# EAGLE schematic untitled (EAGLE 9.5.0)
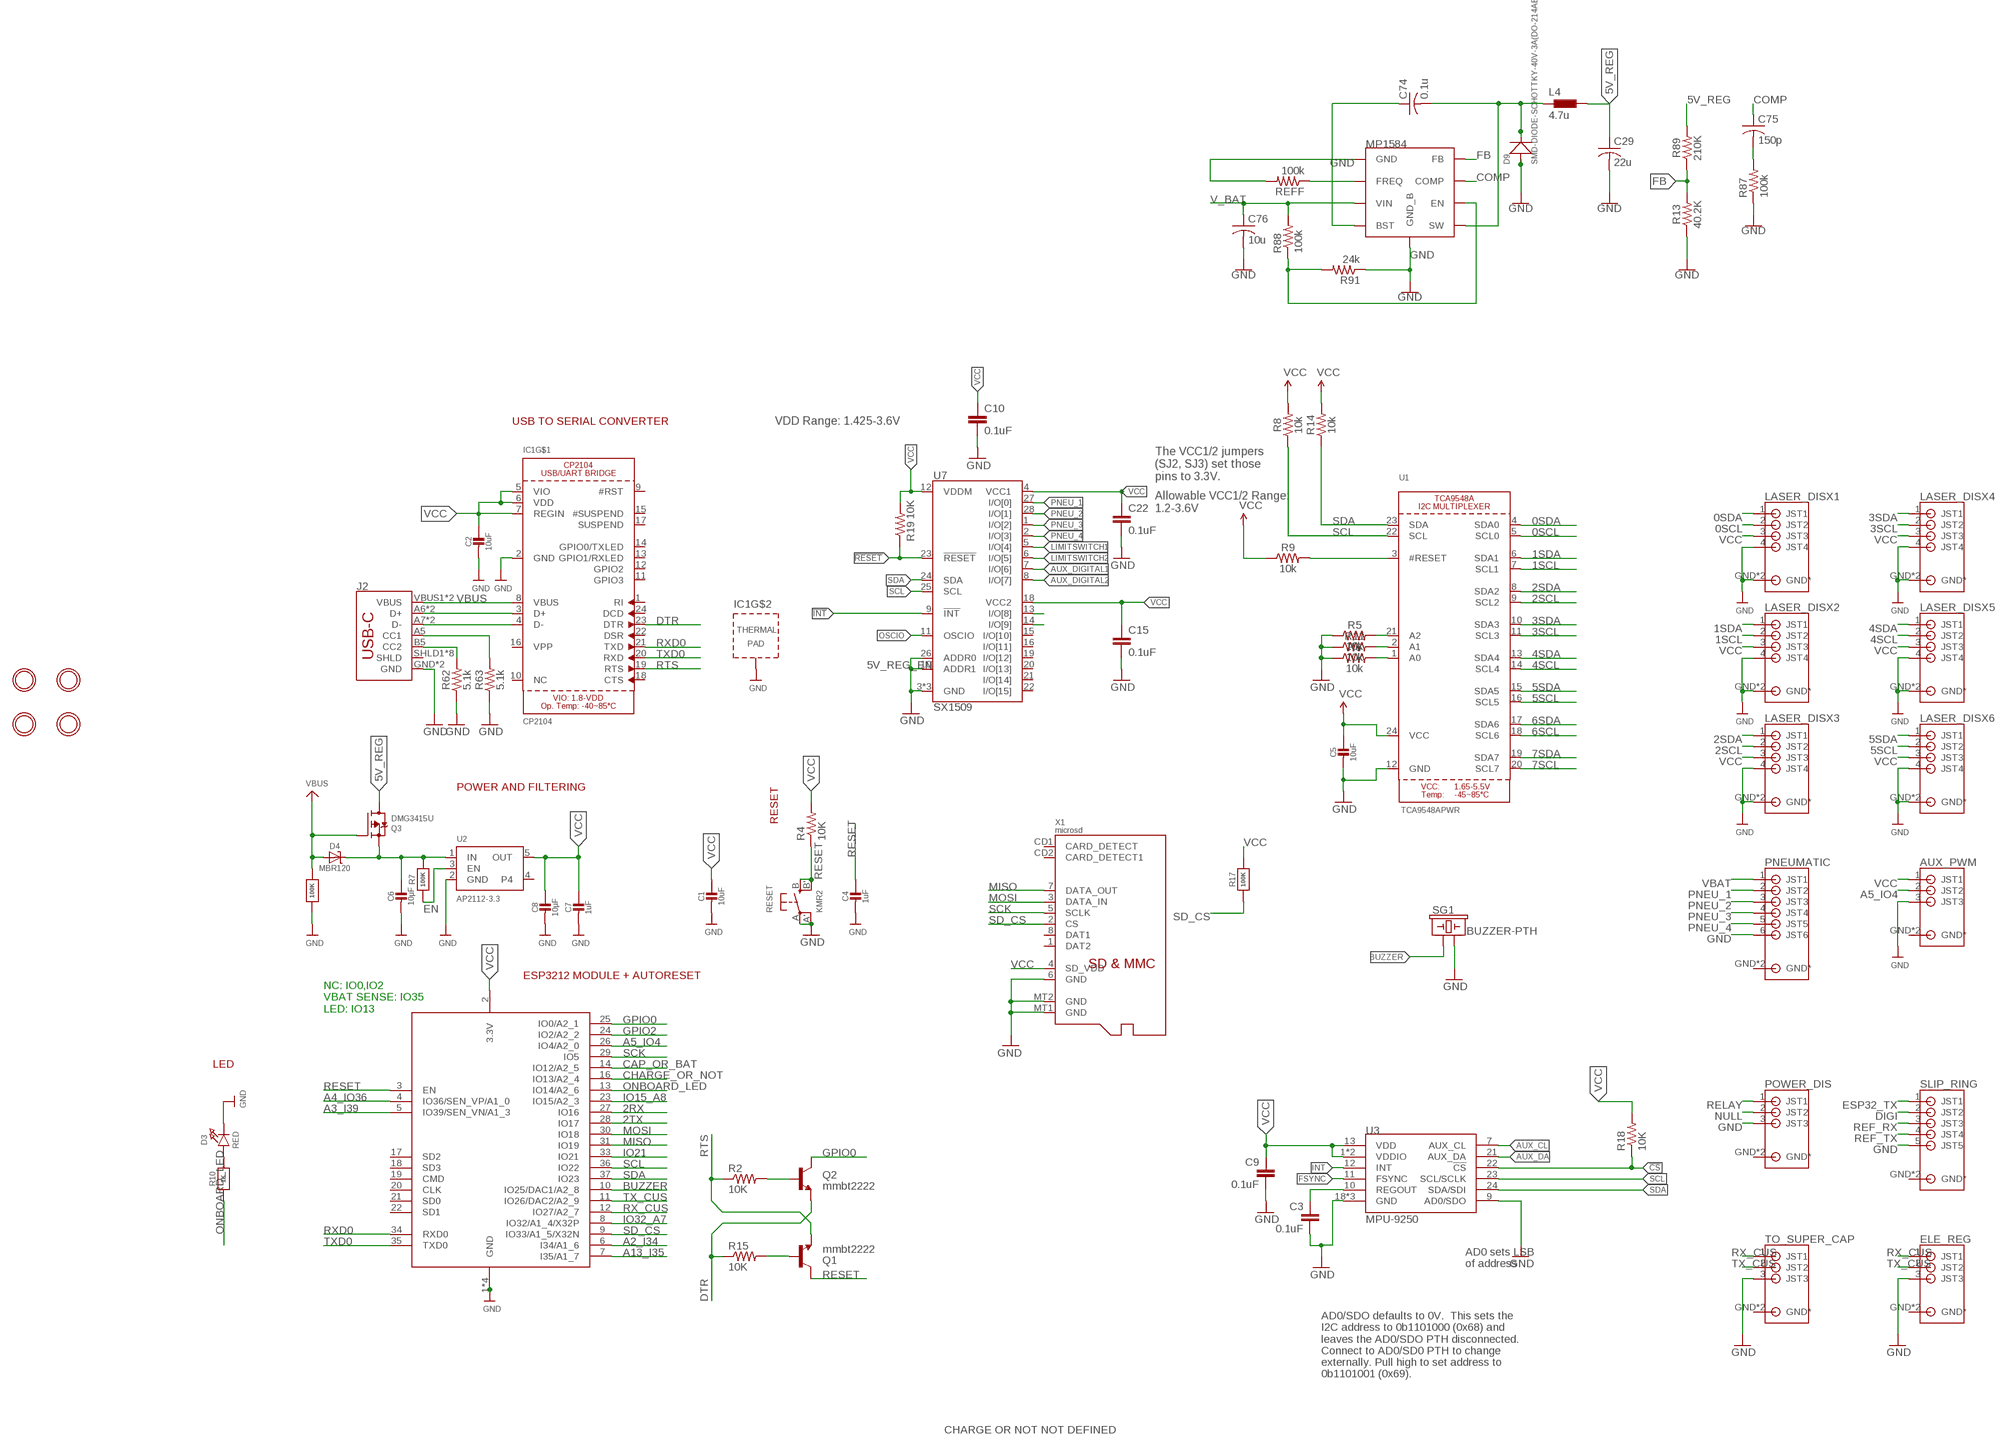
[diagram p0: schematic, sheet 1, part 1 of 2]
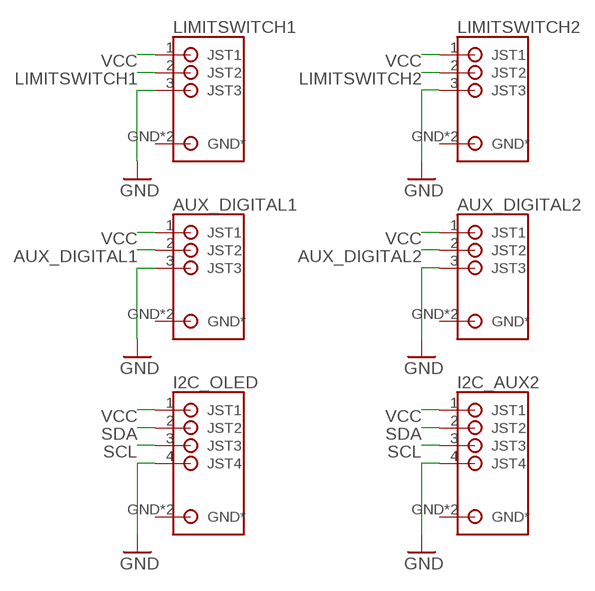
[diagram p1: schematic, sheet 1, part 2 of 2]

## Parts
AUX_DIGITAL1  S3B-PH-SM4_TB  [S3B-PH-SM4_TB]
AUX_DIGITAL2  S3B-PH-SM4_TB  [S3B-PH-SM4_TB]
AUX_PWM  S3B-PH-SM4_TB  [S3B-PH-SM4_TB]
C1  10uF  CAP_CERAMIC0805-NOOUTLINE  [0805-NO]
C2  10uF  CAP_CERAMIC0805-NOOUTLINE  [0805-NO]
C3  0.1uF  0.1UF-25V(+80/-20%)(0603)  [0603-CAP]
C4  1uF  CAP_CERAMIC0603_NO  [0603-NO]
C5  10uF  CAP_CERAMIC0805-NOOUTLINE  [0805-NO]
C6  10µF  CAP_CERAMIC0805-NOOUTLINE  [0805-NO]
C7  1uF  CAP_CERAMIC0603_NO  [0603-NO]
C8  10µF  CAP_CERAMIC0805-NOOUTLINE  [0805-NO]
C9  0.1uF  0.1UF-25V(+80/-20%)(0603)  [0603-CAP]
C10  0.1uF  0.1UF-25V(+80/-20%)(0603)  [0603-CAP]
C15  0.1uF  0.1UF-25V(+80/-20%)(0603)  [0603-CAP]
C22  0.1uF  0.1UF-25V(+80/-20%)(0603)  [0603-CAP]
C29  22u  C-USC1206  [C1206]
C74  0.1u  C-USC0603  [C0603]
C75  150p  C-USC0603  [C0603]
C76  10u  C-USC1206  [C1206]
D3  RED  LED0805_NOOUTLINE  [CHIPLED_0805_NOOUTLINE]
D4  MBR120  DIODE-SCHOTTKYSOD-123  [SOD-123]
D9  SMD-DIODE-SCHOTTKY-40V-3A(DO-214AB)  [DO-214AB]
ELE_REG  S3B-PH-SM4_TB  [S3B-PH-SM4_TB]
I2C_AUX2  S4B-PH-SM4_TB  [S4B-PH-SM4_TB]
I2C_OLED  S4B-PH-SM4_TB  [S4B-PH-SM4_TB]
IC1  CP2104  [QFN24_4MM_SMSC]
J2  USB_C16PIN  [USB-C-16P]
L4  4.7u  MHCI0603-4R7M-R8  [MHCI0603-4R7M-R8]
LASER_DISX1  S4B-PH-SM4_TB  [S4B-PH-SM4_TB]
LASER_DISX2  S4B-PH-SM4_TB  [S4B-PH-SM4_TB]
LASER_DISX3  S4B-PH-SM4_TB  [S4B-PH-SM4_TB]
LASER_DISX4  S4B-PH-SM4_TB  [S4B-PH-SM4_TB]
LASER_DISX5  S4B-PH-SM4_TB  [S4B-PH-SM4_TB]
LASER_DISX6  S4B-PH-SM4_TB  [S4B-PH-SM4_TB]
LIMITSWITCH1  S3B-PH-SM4_TB  [S3B-PH-SM4_TB]
LIMITSWITCH2  S3B-PH-SM4_TB  [S3B-PH-SM4_TB]
PNEUMATIC  S6B-PH-SM4_TB  [S6B-PH-SM4_TB]
POWER_DIS  S3B-PH-SM4_TB  [S3B-PH-SM4_TB]
Q1  mmbt2222  TRANSISTOR_NPNSOT23-3  [SOT23-3]
Q2  mmbt2222  TRANSISTOR_NPNSOT23-3  [SOT23-3]
Q3  DMG3415U  MOSFET-P  [SOT23-R]
R2  10K  10KOHM-1/10W-1%(0603)0603  [0603-RES]
R4  10K  10KOHM-1/10W-1%(0603)0603  [0603-RES]
R5  10k  10KOHM-0603-1/10W-1%  [0603]
R6  10k  10KOHM-0603-1/10W-1%  [0603]
R7  100K  RESISTOR_0603_NOOUT  [0603-NO]
R8  10k  10KOHM-0603-1/10W-1%  [0603]
R9  10k  10KOHM-0603-1/10W-1%  [0603]
R10  1K  RESISTOR_0603_NOOUT  [0603-NO]
R11  10k  10KOHM-0603-1/10W-1%  [0603]
R12  100K  RESISTOR_0603_NOOUT  [0603-NO]
R13  40.2K  220KOHM-0603-1/10W-1%  [0603]
R14  10k  10KOHM-0603-1/10W-1%  [0603]
R15  10K  10KOHM-1/10W-1%(0603)0603  [0603-RES]
R17  100K  RESISTOR_0603_NOOUT  [0603-NO]
R18  10K  10KOHM-1/10W-1%(0603)0603  [0603-RES]
R19  10K  10KOHM-1/10W-1%(0603)0603  [0603-RES]
R62  5.1k  5.1KOHM5.1KOHM-0603-1/10W-1%  [0603]
R63  5.1k  5.1KOHM5.1KOHM-0603-1/10W-1%  [0603]
R87  100k  R-US_R0603  [R0603]
R88  100k  R-US_R0603  [R0603]
R89  210K  RESISTOR0603  [0603]
R91  24k  R-US_R0603  [R0603]
REFF  100k  R-US_R0603  [R0603]
RESET  KMR2  SWITCH_TACT_SMT4.6X2.8  [BTN_KMR2_4.6X2.8]
SG1  BUZZER-PTH  [BUZZER-12MM]
SLIP_RING  S5B-PH-SM4_TB  [S5B-PH-SM4_TB]
TO_SUPER_CAP  S3B-PH-SM4_TB  [S3B-PH-SM4_TB]
U1  TCA9548APWR  TCA9548A  [TSSOP24]
U2  AP2112-3.3  VREG_SOT23-5  [SOT23-5]
U3  MPU-9250  [QFN24_PAD]
U7  SX1509  [QFN-28]
U$2  MOUNTINGHOLE2.5  [MOUNTINGHOLE_2.5_PLATED]
U$7  MOUNTINGHOLE2.5  [MOUNTINGHOLE_2.5_PLATED]
U$10  MOUNTINGHOLE2.5  [MOUNTINGHOLE_2.5_PLATED]
U$11  MP1584_V2  [MP1584_V2]
U$49  MOUNTINGHOLE2.5  [MOUNTINGHOLE_2.5_PLATED]
X1  microsd  MICROSD  [MICROSD]
X2  ESP32_WROOM32_SKINNY  [WROOM32_SKINNY]

## Nets
0SCL: LASER_DISX1.2(JST2) U1.5(SCL0)
0SDA: LASER_DISX1.1(JST1) U1.4(SDA0)
1SCL: LASER_DISX2.2(JST2) U1.7(SCL1)
1SDA: LASER_DISX2.1(JST1) U1.6(SDA1)
2RX [sig]: X2.27(IO16)
2SCL: LASER_DISX3.2(JST2) U1.9(SCL2)
2SDA: LASER_DISX3.1(JST1) U1.8(SDA2)
2TX [sig]: X2.28(IO17)
3SCL: LASER_DISX4.2(JST2) U1.11(SCL3)
3SDA: LASER_DISX4.1(JST1) U1.10(SDA3)
4SCL: LASER_DISX5.2(JST2) U1.14(SCL4)
4SDA: LASER_DISX5.1(JST1) U1.13(SDA4)
5SCL: LASER_DISX6.2(JST2) U1.16(SCL5)
5SDA: LASER_DISX6.1(JST1) U1.15(SDA5)
5V_REG [Power]: C29.1 L4.P$2 Q3.3(D) R89.2
5V_REG_EN1: R88.1 R91.2 U$11.EN
6SCL: U1.18(SCL6)
6SDA: U1.17(SDA6)
7SCL: U1.20(SCL7)
7SDA: U1.19(SDA7)
!CS: R18.1 U3.22(!CS)
!INT: U7.9(!INT)
!RESET: R19.1 U7.23(!RESET)
A0: R6.2 U1.1(A0)
A1: R11.2 U1.2(A1)
A2: R5.2 U1.21(A2)
A2_I34 [sig]: X2.6(I34/A1_6)
A3_I39 [sig]: X2.5(IO39/SEN_VN/A1_3)
A4_IO36 [sig]: X2.4(IO36/SEN_VP/A1_0)
A5_IO4 [sig]: AUX_PWM.2(JST2) X2.26(IO4/A2_0)
A13_I35 [sig]: X2.7(I35/A1_7)
AUX_CL: U3.7(AUX_CL)
AUX_DA: U3.21(AUX_DA)
AUX_DIGITAL1: AUX_DIGITAL1.2(JST2) U7.7(I/O[6])
AUX_DIGITAL2: AUX_DIGITAL2.2(JST2) U7.8(I/O[7])
BST: C74.1 U$11.BST
BUZZER [sig]: SG1.+ X2.10(IO25/DAC1/A2_8)
CAP_OR_BAT: X2.14(IO12/A2_5)
CC1: J2.A5(CC1) R63.2
CC2: J2.B5(CC2) R62.2
CHARGE_OR_NOT: X2.16(IO13/A2_4)
COMP: C75.1 U$11.COMP
DIGI: SLIP_RING.2(JST2)
DIR_1: U7.13(I/O[8])
DIR_2: U7.14(I/O[9])
DTR: IC1.23(DTR) Q2.2(E) R15.1
EN: R7.1 U2.3(EN)
ESP32_TX: SLIP_RING.1(JST1)
FB: R13.2 R89.1 U$11.FB
FREQ: REFF.1 U$11.FREQ
FSYNC: U3.11(FSYNC)
GND: AUX_DIGITAL1.3(JST3) AUX_DIGITAL2.3(JST3) AUX_PWM.3(JST3) C1.2 C2.2 C3.2 C4.2 C5.2 C6.2 C7.2 C8.2 C9.2 C10.2 C15.2 C22.2 C29.2 C76.2 D3.C D9.1(+) ELE_REG.3(JST3) I2C_AUX2.4(JST4) I2C_OLED.4(JST4) IC1.2(GND) IC1.THERM(TP) J2.GND J2.GND2(GND) LASER_DISX1.4(JST4) LASER_DISX1.GND2(GND*) LASER_DISX1.GND(GND*) LASER_DISX2.4(JST4) LASER_DISX2.GND2(GND*) LASER_DISX2.GND(GND*) LASER_DISX3.4(JST4) LASER_DISX3.GND2(GND*) LASER_DISX3.GND(GND*) LASER_DISX4.4(JST4) LASER_DISX4.GND2(GND*) LASER_DISX4.GND(GND*) LASER_DISX5.4(JST4) LASER_DISX5.GND2(GND*) LASER_DISX5.GND(GND*) LASER_DISX6.4(JST4) LASER_DISX6.GND2(GND*) LASER_DISX6.GND(GND*) LIMITSWITCH1.3(JST3) LIMITSWITCH2.3(JST3) PNEUMATIC.6(JST6) POWER_DIS.3(JST3) R5.1 R6.1 R11.1 R12.1 R13.1 R62.1 R63.1 R87.1 R91.1 REFF.2 RESET.A'(P1) RESET.A(P) SG1.- SLIP_RING.5(JST5) TO_SUPER_CAP.3(JST3) U1.12(GND) U2.2(GND) U3.9(AD0/SDO) U3.18(GND) U3.20(GND) U3.CENTER(GND) U7.3(GND) U7.10(ADDR1) U7.17(GND) U7.26(ADDR0) U7.29(GND) U$11.GND U$11.GND_B X1.6(GND) X1.MT1(GND) X1.MT2(GND) X2.1(GND) X2.15(GND) X2.38(GND) X2.P$1(GND)
GPIO0: Q2.3(C) X2.25(IO0/A2_1)
GPIO2 [sig]: X2.24(IO2/A2_2)
INT: U3.12(INT)
IO15_A8 [sig]: X2.23(IO15/A2_3)
IO21 [sig]: X2.33(IO21)
IO32_A7 [sig]: X2.8(IO32/A1_4/X32P)
LIMITSWITCH1: LIMITSWITCH1.2(JST2) U7.5(I/O[4])
LIMITSWITCH2: LIMITSWITCH2.2(JST2) U7.6(I/O[5])
MISO [sig]: X1.7(DATA_OUT) X2.31(IO19)
MOSI [sig]: X1.3(DATA_IN) X2.30(IO18)
N$1: C75.2 R87.2
N$5: D3.A R10.2
N$7: C6.1 D4.C Q3.2(S) R7.2 U2.1(IN)
N$10: R9.2 U1.3(#RESET)
N$12: Q1.1(B) R15.2
N$13: Q2.1(B) R2.2
N$27: IC1.3(D+) J2.A6(D+) J2.B6(D+)
N$28: IC1.4(D-) J2.A7(D-) J2.B7(D-)
NULL: POWER_DIS.2(JST2)
ONBOARD_LED [sig]: R10.1 X2.13(IO14/A2_6)
OSCIO: U7.11(OSCIO)
PNEU_1: PNEUMATIC.2(JST2) U7.27(I/O[0])
PNEU_2: PNEUMATIC.3(JST3) U7.28(I/O[1])
PNEU_3: PNEUMATIC.4(JST4) U7.1(I/O[2])
PNEU_4: PNEUMATIC.5(JST5) U7.2(I/O[3])
REF_RX: SLIP_RING.3(JST3)
REF_TX: SLIP_RING.4(JST4)
REGOUT: C3.1 U3.10(REGOUT)
RELAY: POWER_DIS.1(JST1)
RESET [sig]: C4.1 Q1.3(C) R4.1 RESET.B'(S1) RESET.B(S) X2.3(EN)
RTS: IC1.19(RTS) Q1.2(E) R2.1
RX_CUS [sig]: ELE_REG.1(JST1) TO_SUPER_CAP.1(JST1) X2.12(IO27/A2_7)
RXD0 [sig]: IC1.21(TXD) X2.34(RXD0)
SCK [sig]: X1.5(SCLK) X2.29(IO5)
SCL [sig]: I2C_AUX2.3(JST3) I2C_OLED.3(JST3) R8.1 U1.22(SCL) U3.23(SCL/SCLK) U7.25(SCL) X2.36(IO22)
SD_CS: R17.1 X1.2(CS) X2.9(IO33/A1_5/X32N)
SDA [sig]: I2C_AUX2.2(JST2) I2C_OLED.2(JST2) R14.1 U1.23(SDA) U3.24(SDA/SDI) U7.24(SDA) X2.37(IO23)
SW: C74.2 D9.2(-) L4.P$1 U$11.SW
TX_CUS [sig]: ELE_REG.2(JST2) TO_SUPER_CAP.2(JST2) X2.11(IO26/DAC2/A2_9)
TXD0 [sig]: IC1.20(RXD) X2.35(TXD0)
V_BAT [Power]: C76.1 R88.2 U$11.VIN
VBAT: PNEUMATIC.1(JST1)
VBUS: D4.A IC1.8(VBUS) J2.VBUS1(VBUS) J2.VBUS2(VBUS) Q3.1(G) R12.2
VCC: AUX_DIGITAL1.1(JST1) AUX_DIGITAL2.1(JST1) AUX_PWM.1(JST1) C1.1 C2.1 C5.1 C7.1 C8.1 C9.1 C10.1 C15.1 C22.1 I2C_AUX2.1(JST1) I2C_OLED.1(JST1) IC1.5(VIO) IC1.6(VDD) IC1.7(REGIN) LASER_DISX1.3(JST3) LASER_DISX2.3(JST3) LASER_DISX3.3(JST3) LASER_DISX4.3(JST3) LASER_DISX5.3(JST3) LASER_DISX6.3(JST3) LIMITSWITCH1.1(JST1) LIMITSWITCH2.1(JST1) R4.2 R8.2 R9.1 R14.2 R17.2 R18.2 R19.2 U1.24(VCC) U2.5(OUT) U3.1(VDDIO) U3.8(VDDIO) U3.13(VDD) U7.4(VCC1) U7.12(VDDM) U7.18(VCC2) X1.4(SD_VDD) X2.2(3.3V)
Unconnected: AUX_DIGITAL1.GND2(GND*) AUX_DIGITAL1.GND(GND*) AUX_DIGITAL2.GND2(GND*) AUX_DIGITAL2.GND(GND*) AUX_PWM.GND2(GND*) AUX_PWM.GND(GND*) ELE_REG.GND2(GND*) ELE_REG.GND(GND*) I2C_AUX2.GND2(GND*) I2C_AUX2.GND(GND*) I2C_OLED.GND2(GND*) I2C_OLED.GND(GND*) IC1.1(RI) IC1.9(#RST) IC1.10(NC) IC1.11(GPIO3) IC1.12(GPIO2) IC1.13(GPIO1/RXLED) IC1.14(GPIO0/TXLED) IC1.15(#SUSPEND) IC1.16(VPP) IC1.17(SUSPEND) IC1.18(CTS) IC1.22(DSR) IC1.24(DCD) J2.SHLD1(SHLD) J2.SHLD2(SHLD) J2.SHLD3(SHLD) J2.SHLD4(SHLD) J2.SHLD5(SHLD) J2.SHLD6(SHLD) J2.SHLD7(SHLD) J2.SHLD8(SHLD) LIMITSWITCH1.GND2(GND*) LIMITSWITCH1.GND(GND*) LIMITSWITCH2.GND2(GND*) LIMITSWITCH2.GND(GND*) PNEUMATIC.GND2(GND*) PNEUMATIC.GND(GND*) POWER_DIS.GND2(GND*) POWER_DIS.GND(GND*) SLIP_RING.GND2(GND*) SLIP_RING.GND(GND*) TO_SUPER_CAP.GND2(GND*) TO_SUPER_CAP.GND(GND*) U2.4 U7.15(I/O[10]) U7.16(I/O[11]) U7.19(I/O[12]) U7.20(I/O[13]) U7.21(I/O[14]) U7.22(I/O[15]) X1.1(DAT2) X1.8(DAT1) X1.CD1(CARD_DETECT) X1.CD2(CARD_DETECT1) X2.17(SD2) X2.18(SD3) X2.19(CMD) X2.20(CLK) X2.21(SD0) X2.22(SD1)

## Notes on the sheet
- USB TO SERIAL CONVERTER | VDD Range: 1.425-3.6V
- The VCC1/2 jumpers 
  (SJ2, SJ3) set those 
  pins to 3.3V.
- Allowable VCC1/2 Range: 
  1.2-3.6V
- POWER AND FILTERING
- RESET
- ESP3212 MODULE + AUTORESET
- NC: IO0,IO2
  VBAT SENSE: IO35
  LED: IO13
- LED
- AD0 sets LSB
  of address
- AD0/SDO defaults to 0V.  This sets the
  I2C address to 0b1101000 (0x68) and
  leaves the AD0/SDO PTH disconnected.
  Connect to AD0/SD0 PTH to change
  externally. Pull high to set address to
  0b1101001 (0x69).
- CHARGE OR NOT NOT DEFINED

## Library data of the parts
AUX_DIGITAL1 AUX_DIGITAL2 AUX_PWM ELE_REG LIMITSWITCH1 LIMITSWITCH2 POWER_DIS TO_SUPER_CAP = NewKevinMade:S3B-PH-SM4_TB
C1 C2 C4-C8 = microbuilder:CAP_CERAMIC: Ceramic Capacitors For new designs, use the packages preceded by an '_' character since they are more reliable: The following footprints should be used on most boards: _0402 - Standard footprint for regular board layouts _0603 - Standard footprint for regular board layouts _0805 - Standard footprint for regular board layouts _1206 - Standard footprint for regular board layouts For extremely tight-pitch boards where space is at a premium, the following 'micro-pitch' footprints can be used (smaller pads, no silkscreen outline, etc.): _0402MP - Micro-pitch footprint for very dense/compact boards _0603MP - Micro-pitch footprint for very dense/compact boards _0805MP - Micro-pitch footprint for very dense/compact boards _1206MP - Micro-pitch footprint for very dense/compact boards
C3 C9 C10 C15 C22 = SparkFun-Capacitors:0.1UF-25V(+80/-20%)(0603): CAP-00810 Ceramic Standard decoupling cap; PROD_ID: CAP-00810
C29 C74-C76 = adafruit:C-US: CAPACITOR, American symbol
D3 = microbuilder:LED: LED 0603 - 0603 Surface Mount Package 2mA: Green LED - Low Power (3.9mcd, 2ma, 1.7Vf) - Digikey: 475-2709-2-ND Orange LED - Low Power (9.8mcd, 2ma, 1.8Vf) - Digikey: 475-1194-2-ND Red LED - Low Power (5mcd, 2ma, 1.8Vf) - Digikey: 475-1195-2-ND Yellow LED - Low Power (7mcd, 2ma, 1.8Vf) - Digikey: 475-1196-2-ND 5mA: Blue LED - Low Power (17mcd, 5ma, 2.9Vf) - Digikey: LNJ937W8CRACT-ND 0805 - 0805 Surface Mount Package 2mA: Red LED (8.8mcd, 2mA, 1.8Vf, Clear) - Low Power [Digikey: 475-2510-1-ND] Green LED (5mcd, 2mA, 1.8Vf, Clear) - Low Power [Digikey: 475-2730-1-ND] Yellow LED (11.3mcd, 2mA, 1.8Vf, Clear) - Low Power [Digikey: 475-2555-1-ND] 20mA: Red LED (104mcd, 20mA, Diffused) - LS R976 [Digikey: 475-1278-6-ND] Red LED (12mcd, 20mA, 2.0Vf, Clear) - APT2012EC [Digikey: 754-1128-1-ND] Green LED (15mcd, 20mA, 2.2Vf, Clear) - APT2012GC [Digikey: 754-1131-1-ND] Orange LED (160mcd, 20mA, 2.1Vf, Clear) - APT2012SECK [Digikey: 754-1130-1-ND] 1206 - 1206 Surface Mount Package Green LED (26mcd, 20mA, Diffused) - LG N971 [Digikey: 475-1407-6-ND] Red LED (15mcd, 20mA, Diffused) - LH N974 [Digikey: 475-1416-6-ND] Cree - Cree High-Power Surface Mount LEDs XPEBWT-L1-0000-00D50 - White 111lm 350mA 2.9Vf 6200K 110° XTEAWT-00-0000-00000LEE3 - White 114lm 350mA 2.85Vf 5000K 115° Everlight - Everlight 45-21 Series Surface Mount LEDs 45-21/QK2C-B2832AC2CB2/2T - Warm White 2000mcd 20mA 3.25Vf 3050K 120° 45-21/LK2C-B38452C4CB2/2T - Nuetral White 2000mcd 20mA 3.25Vf 4150K 120° 45-21/LK2C-B50634C6CB2/2T - Cold White 2200mcd 20mA 3.25Vf 5650K 120° PLCC2 Reverse Mount LS T77K-J1L2-1-0-2-R18-Z - Red 11.25mcd 2mA 1.8Vf 630nm 120° LO T77K-L1M2-24-Z - Orange 19.6mcd 2mA 1.8Vf 606nm 120° LY T77K-K2M1-26-Z - Yellow 15.7mcd 2mA 1.8Vf 587nm 120°
D4 = microbuilder:DIODE-SCHOTTKY
D9 = SMD-DIODE-SCHOTTKY-40V-3A_DO-214AB_:SMD-DIODE-SCHOTTKY-40V-3A(DO-214AB): 304020018; AVAILABILITY: Unavailable; DESCRIPTION: Rectifier, Schottky; DO-214AB; 3.0A IF; 0.75V; 40V; 100A IFRM; 10000V/us; 1000pF; MF: Vishay; MP: SS34-E3/57T; PACKAGE: DO-214 Vishay; PRICE: None
I2C_AUX2 I2C_OLED = NewKevinMade:S4B-PH-SM4_TB
IC1 = microbuilder:CP2104: CP2104 - USB to UART Bridge VDD Output: 3.45V
J2 = SparkFun-Connectors:USB_C: USB Type C 16Pin Connector Super Speed pins not available on the 16-pin purely SMD connector so this part is best for USB 2.0 implementations. D1 and D2 are tied together enabling D+/- no matter which way the cable is plugged into the connector. The two channel configuration pins (CC1/2) are exposed. These are normally connected to ground via 5.1k resistors but can be reconfigured for high current/high power applications.; PROD_ID: CONN-14122
L4 = NewKevinMade:MHCI0603-4R7M-R8
LASER_DISX1-LASER_DISX6 = KevinMade:S4B-PH-SM4_TB
PNEUMATIC = NewKevinMade:S6B-PH-SM4_TB
Q1 Q2 = SparkFun:TRANSISTOR_NPN: Transistor NPN BJT configuration in SOT23 package. MMBT2222 is the common NPN we use. Double check BCE configuration again layout.
Q3 = microbuilder:MOSFET-P: P-Channel Mosfet LEGEND VDS: Voltage Drain-Source ID: Drain Current RDS(ON): Drain-Source On-State Resistance VGS(TH): Gate-Source Threshold Voltage CISS: Drain-Source Input Capacitance SOT-23 Name VDS ID RDS(ON) VGS(TH) CISS Order Number IRLML5103 30V 760mA 600 mOhm -- 75pF @ 25V Digikey: IRLML5103PBFCT-ND IRLML6401 12V 4.3A 50 mOhm 950mV @ 250µA 830pF @ 10V Digikey: IRLML6401PBFTR-ND NTR0202PL 20V 400mA 800 mOhm 2.3V @ 250uA 70pF @ 5V Digikey: NTR0202PLT1GOSTR-ND NTR4101PT1G 20V 1.8A 85 mOhm 1.2V @ 250uA 675pF @ 10V Digikey: NTR4101PT1GOSCT-ND DMP2004K 20V 600mA 900 mOhm 1V @ 250uA 175pF @ 16V Digikey: DMP2004KDICT-ND PMV65XP 20V 3.9A 76 mOhm 950mV @ 1mA 725pF @ 20V Digikey: 568-2358-2-ND TO-252 Name VDS ID RDS(ON) VGS(TH) CISS Order Number AOD417 30V 25A 34 mOhm 3V @ 250µA 920pF @ 15V Digikey: 785-1106-2-ND PowerPak Name VDS ID RDS(ON) VGS(TH) CISS Order Number AON7401 30V 12A 14 mOhm 3V @ 250µA 2600pF @ 15V Digikey: 785-1302-1-ND
R2 R4 R15 R18 R19 = SparkFun-Resistors:10KOHM-1/10W-1%(0603): RES-00824; PROD_ID: RES-00824
R5 R6 R8 R9 R11 R14 = SparkFun-Resistors:10KOHM: 10kΩ resistor A resistor is a passive two-terminal electrical component that implements electrical resistance as a circuit element. Resistors act to reduce current flow, and, at the same time, act to lower voltage levels within circuits. - Wikipedia; PROD_ID: RES-00824
R7 R10 R12 R17 = microbuilder:RESISTOR: Resistors For new designs, use the packages preceded by an '_' character since they are more reliable: The following footprints should be used on most boards: _0402 - Standard footprint for regular board layouts _0603 - Standard footprint for regular board layouts _0805 - Standard footprint for regular board layouts _1206 - Standard footprint for regular board layouts For extremely tight-pitch boards where space is at a premium, the following 'micro-pitch' footprints can be used (smaller pads, no silkscreen outline, etc.): _0402MP - Micro-pitch footprint for very dense/compact boards _0603MP - Micro-pitch footprint for very dense/compact boards _0805MP - Micro-pitch footprint for very dense/compact boards _1206MP - Micro-pitch footprint for very dense/compact boards
R13 = SparkFun-Resistors:220KOHM: 220kΩ resistor A resistor is a passive two-terminal electrical component that implements electrical resistance as a circuit element. Resistors act to reduce current flow, and, at the same time, act to lower voltage levels within circuits. - Wikipedia; PROD_ID: RES-08969; VALUE: 220k
R62 R63 = SparkFun-Resistors:5.1KOHM; PROD_ID: RES-12083
R87 R88 R91 REFF = adafruit:R-US_: RESISTOR, American symbol
R89 = SparkFun-Resistors:RESISTOR: Generic Resistor Package
RESET = microbuilder:SWITCH_TACT_SMT: SMT Tact Switches 6x6mm - Digikey: P12940SCT-ND KMR2 (4.6x2.8mm) - Digikey: 401-1426-1-ND EVQ-PQHB55 - Light Touch, 160GF (4.5x4.5mm) - Digikey: P8090SCT-ND KMT0 - KMT021 NGJ LHS (etc.) IP68/Waterproof - Digikey: CKN10289CT-ND
SG1 = SparkFun-Electromechanical:BUZZER: Buzzer Small round buzzers that operate around the audible 2kHz range. You can use these as speakers to create simple music or user interfaces. Variant Overview: PTH - Mini Speaker - PC Mount 12mm 2.048kHz <https://www.sparkfun.com/products/7950> PTH_KIT - Mini Speaker - PC Mount 12mm 2.048kHz <https://www.sparkfun.com/products/7950> KIT simplifies soldering by adding stop mask to one side of the pads. PTH_NO_SILK - Mini Speaker - PC Mount 12mm 2.048kHz <https://www.sparkfun.com/products/7950> No silkscreen indicator of buzzer outline. PTH_KIT_NO_SILK - Mini Speaker - PC Mount 12mm 2.048kHz <https://www.sparkfun.com/products/7950> KIT package w/o silkscreen SMD - Buzzer Audio Magnetic (CCV-084B16) SMD buzzer used on, e.g. the LilyPad Buzzer <https://www.sparkfun.com/products/8463> and RFID USB Reader <https://www.sparkfun.com/products/9963>. SMD_KIT - Buzzer Audio Magnetic (CCV-084B16) SMD Buzzer with elongated pins to make soldering easier. Used on the SparkFun Simon Says - Surface Mount Soldering Kit <https://www.sparkfun.com/products/10935>.; PROD_ID: COMP-08253; SF_SKU: COM-07950
SLIP_RING = NewKevinMade:S5B-PH-SM4_TB
U1 = microbuilder:TCA9548A: TCA9548A I2C Multiplexer
U2 = microbuilder:VREG_SOT23-5: SOT23-5 Fixed Voltage Regulators Part Current Out V Out V In V Dropout θJA (°C/W) TJ (°C) Digikey Part No. ADP121 150mA 3.3V 3.4-5.5V 0.09V @ 150mA -- -- ADP121-AUJZ33R7CT-ND ADP121 150mA 3.0V 3.1-5.5V 0.09V @ 150mA -- -- ADP121-AUJZ30R7CT-ND ADP122 300mA 3.3V 3.4-5.5V 0.085V @ 300mA -- -- ADP122AUJZ-3.3-R7CT-ND ADP1712 300mA 3.3V 3.5-5.5V 0.17V @ 300mA -- -- ADP1712AUJZ-3.3-R7TR-ND AP7311 (Low Cost) 150mA 3.3V 3.5-6V 0.15V @ 150mA -- -- AP7311-33WG-7DICT-ND LD39015M18R 150mA 1.8V 1.9V-5.5V 0.08V @ 100mA -- -- 497-6977-1-ND LP2985A-33DBVR 150mA 3.3V 3.3-16V 0.28V @ 150mA 206 150 296-18479-1-ND MCP1824T-3302E/OT 300mA 3.3V 3.5V-6V 0.2V @ 300mA -- -- MCP1824T-3302E/OTCT-ND MIC5205-2.5YM5 TR 150mA 2.5V 2.7-16V 0.165V @ 150mA -- -- 576-1257-2-ND MIC5205-3.0YM5 TR 150mA 3.0V 3.2V-16V 0.165V @ 150mA -- -- 576-1258-2-ND MIC5205-3.3YM5 TR 150mA 3.3V 3.5V-16V 0.165V @ 150mA -- -- 576-1259-2-ND TPS780330220 150mA 3.3V+2.2V 3.6-5.5V 250mV Max -- -- 296-23332-1-ND TDA3663/N1,135 100mA 3.3V 3.5-45V 0.18V @ 50mA -- -- 568-5343-1-ND Max operating temp can be calculated using θJA, TJ (max junction temperature), and power in watts. Set the "Maximum Ambient Temperature" until it reaches TJ ("Max Junction Temperature"), which is the absolute limit for safe use of the regulator: Heat Sink Temperature Calculator <http://www.daycounter.com/Calculators/Heat-Sink-Temperature-Calculator.phtml> For example, With 12V source into a 3.3V LP2985 and a 30mA load, we are dissipating (12V-3.3V) * 0.03A = 0.261W. With a θJA of 206 °C/W, a TJ of 150°C, and 261mW we can safely use the chip without a heat sink up to 75°C (=147.1°C Junction Temperature).
U3 = Testing:MPU-9250: NC pin 19. 2-6 & 14-17 not internally connected. May be used for PCB trace routing.; PROD_ID: IC-13192
U7 = SparkFun-DigitalIC:SX1509: Semtech SX1509 The SX1509 is a complete ultra low voltage 1.2V to 3.6V General Purpose parallel Input/Output (GPIO) expanders ideal for low power handheld battery powered equipment. This version comes in a 16-channel configuration and allows easy serial expansion of I/O through a standard 400kHz I2C interface. GPIO devices can provide additional control and monitoring when the microcontroller or chipset has insufficient I/O ports, or in systems where serial communication and control from a remote location is advantageous.; PROD_ID: IC-11311
U$2 U$7 U$10 U$49 = microbuilder:MOUNTINGHOLE: Mounting Hole For #2 screws (0.086"/2.18mm width, 0.094"/2.4mm hole) use 2.5mm; BOM: EXCLUDE
U$11 = mp1584S:MP1584_V2
X1 = microbuilder:MICROSD: MicroSD/Transflash Card Holder with SPI pinout 3M: 2908-05WB-MG 4UConnector: 19656 Footprint courtesy: Adafruit Industries
X2 = microbuilder:ESP32_WROOM32

## Net classes
0 default: width 0.305 mm, drill 0.305 mm, clearance 0.254 mm
1 sig: width 0.203 mm, drill 0.203 mm, clearance 0.203 mm
2 Power: width 0.203 mm, drill 0.203 mm, clearance 0.203 mm
3 HighSpeedSig: width 0.152 mm, drill 0.152 mm, clearance 0.203 mm
5 LowPower: width 0.203 mm, drill 0.203 mm, clearance 0.203 mm